# EAGLE design registers_manual3_2reg_newest (EAGLE 9.5.2)
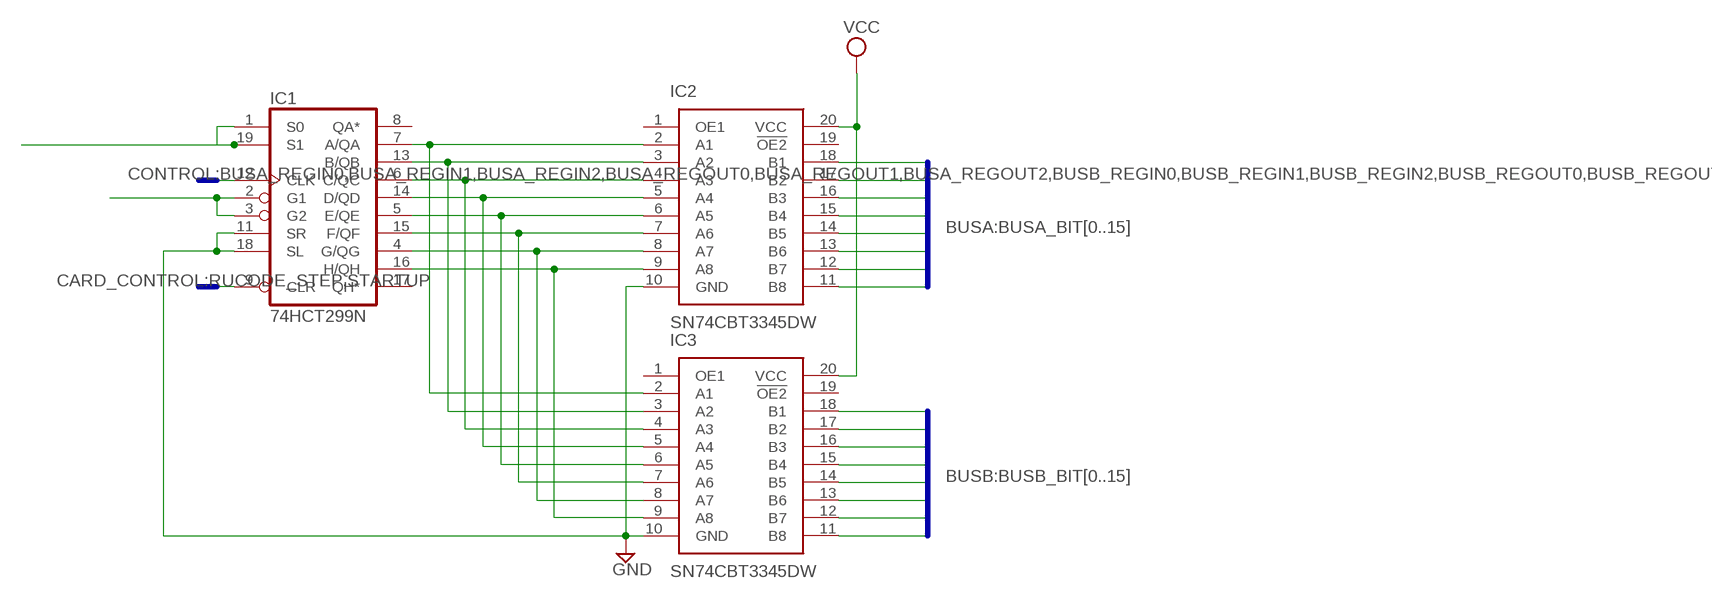
[diagram p0: schematic, sheet 1]

## Parts
IC1  74HCT299N  [DIL20]
IC2  SN74CBT3345DW  [SOIC127P1030X265-20N]
IC3  SN74CBT3345DW  [SOIC127P1030X265-20N]

## Nets
BUSA_BIT0: IC2.18(B1)
BUSA_BIT1: IC2.17(B2)
BUSA_BIT2: IC2.16(B3)
BUSA_BIT3: IC2.15(B4)
BUSA_BIT4: IC2.14(B5)
BUSA_BIT5: IC2.13(B6)
BUSA_BIT6: IC2.12(B7)
BUSA_BIT7: IC2.11(B8)
BUSB_BIT0: IC3.18(B1)
BUSB_BIT1: IC3.17(B2)
BUSB_BIT2: IC3.16(B3)
BUSB_BIT3: IC3.15(B4)
BUSB_BIT4: IC3.14(B5)
BUSB_BIT5: IC3.13(B6)
BUSB_BIT6: IC3.12(B7)
BUSB_BIT7: IC3.11(B8)
CLK: IC1.12(CLK)
GND: IC1.11(SR) IC1.18(SL) IC2.10(GND) IC3.10(GND)
N$12: IC1.2(G1) IC1.3(G2)
N$13: IC1.1(S0) IC1.19(S1)
N$14: IC1.7(A/QA) IC2.2(A1) IC3.2(A1)
N$18: IC1.13(B/QB) IC2.3(A2) IC3.3(A2)
N$20: IC1.6(C/QC) IC2.4(A3) IC3.4(A3)
N$26: IC1.14(D/QD) IC2.5(A4) IC3.5(A4)
N$27: IC1.5(E/QE) IC2.6(A5) IC3.6(A5)
N$29: IC1.15(F/QF) IC2.7(A6) IC3.7(A6)
N$30: IC1.4(G/QG) IC2.8(A7) IC3.8(A7)
N$31: IC1.16(H/QH) IC2.9(A8) IC3.9(A8)
STARTUP: IC1.9(CLR)
VCC: IC2.20(VCC) IC3.20(VCC)
Unconnected: IC1.8(QA*) IC1.17(QH*) IC2.1(OE1) IC2.19(!OE2) IC3.1(OE1) IC3.19(!OE2)

## Buses
CONTROL:BUSA_REGIN0,BUSA_REGIN1,BUSA_REGIN2,BUSA_REGOUT0,BUSA_REGOUT1,BUSA_REGOUT2,BUSB_REGIN0,BUSB_REGIN1,BUSB_REGIN2,BUSB_REGOUT0,BUSB_REGOUT1,BUSB_REGOUT2,CLK
CARD_CONTROL:RUCODE_STEP,STARTUP
BUSA:BUSA_BIT[0..15]
BUSB:BUSB_BIT[0..15]

## Power pins joined to a net without a drawn wire
GND: IC1.10(GND)
VCC: IC1.20(VCC)

## Library data of the parts
IC1 = 74xx-eu:74*299: 8-bit universal SHIFT/STORAGE REGISTER
IC2 IC3 = SamacSys_Parts:SN74CBT3345DW: Texas Instruments SN74CBT3345DW, Bus Switch, 8 x 1:1, 4.5 5.5 V, 20-Pin SOIC Source: Datasheet <https://www.ti.com/lit/ds/symlink/sn74cbt3345.pdf>; DESCRIPTION: Texas Instruments SN74CBT3345DW, Bus Switch, 8 x 1:1, 4.5 5.5 V, 20-Pin SOIC; HEIGHT: 2.65mm; MANUFACTURER_NAME: Texas Instruments; MANUFACTURER_PART_NUMBER: SN74CBT3345DW

## Board
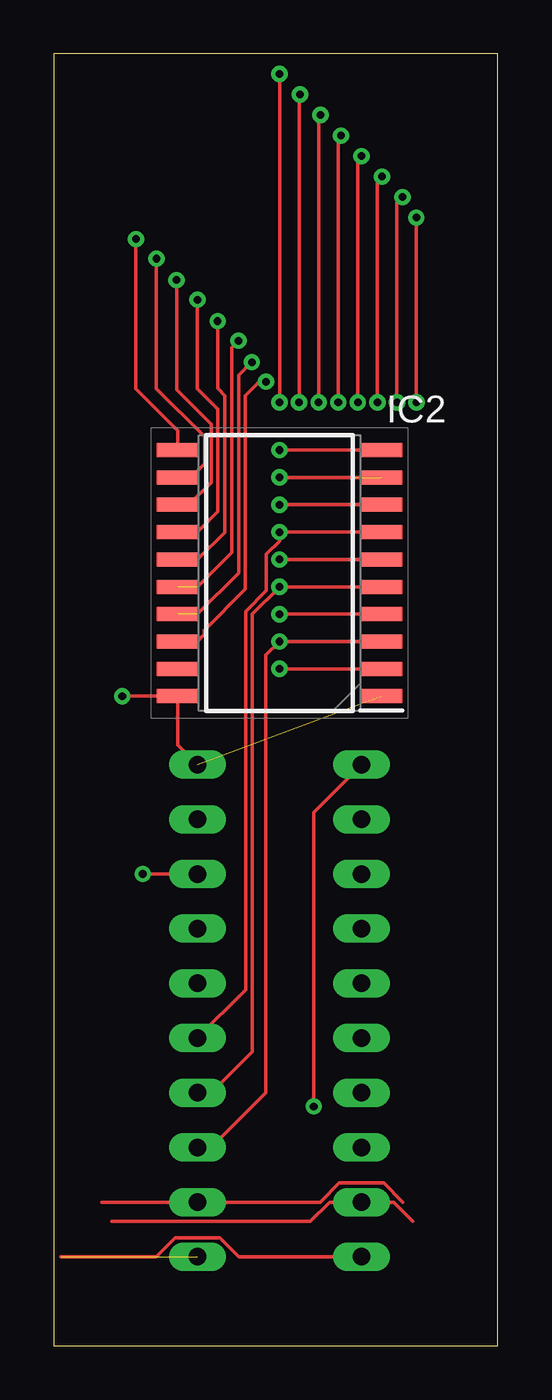
[diagram p1: board, top side]
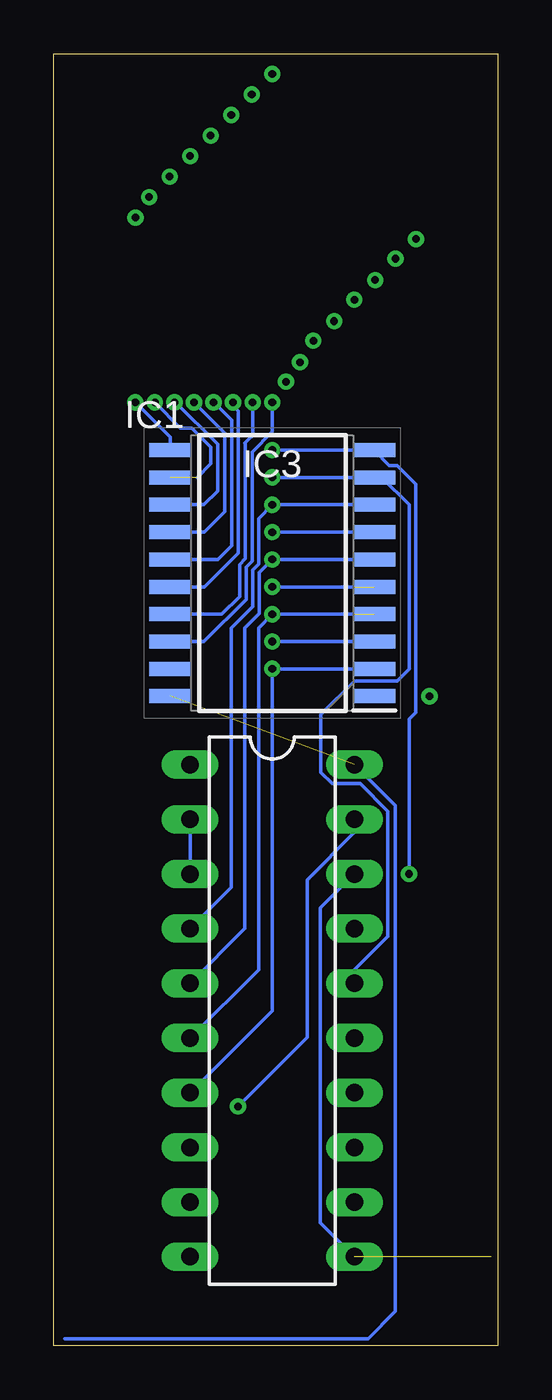
[diagram p2: board, bottom side, seen from below]

Size 20.62 x 59.99 mm. Coordinates in mm from the lower left corner, seen from the top.
Outline: 0,0 20.62,0 20.62,59.99 0,59.99 0,0
Copper layers (1*16): Top 0.035mm / dielectric 1.5mm / Bottom 0.035mm
Design rules "default *": minimum track width 6mil, minimum drill 0.35mm, track to track 6mil, track to pad 6mil, pad to pad 6mil, via to via 6mil, smd to smd 6mil, copper to edge 40mil, drill to drill 6mil, minimum pad ring 10mil, minimum via ring 8mil, stop-mask expansion 4mil, vias tented up to drill 0mil, thermal gap 10mil

### Footprints (pad centres in the part's own frame; a part is rotated, then mirrored left to right if it is on the bottom)
DIL20 = drill 0.813 long: 1 -11.43,-3.81; 2 -8.89,-3.81; 3 -6.35,-3.81; 4 -3.81,-3.81; 5 -1.27,-3.81; 6 1.27,-3.81; 7 3.81,-3.81; 8 6.35,-3.81; 9 8.89,-3.81; 10 11.43,-3.81; 11 11.43,3.81; 12 8.89,3.81; 13 6.35,3.81; 14 3.81,3.81; 15 1.27,3.81; 16 -1.27,3.81; 17 -3.81,3.81; 18 -6.35,3.81; 19 -8.89,3.81; 20 -11.43,3.81
SOIC127P1030X265-20N = smd 1.95 x 0.65: 1 -4.725,5.715; 2 -4.725,4.445; 3 -4.725,3.175; 4 -4.725,1.905; 5 -4.725,0.635; 6 -4.725,-0.635; 7 -4.725,-1.905; 8 -4.725,-3.175; 9 -4.725,-4.445; 10 -4.725,-5.715; 11 4.725,-5.715; 12 4.725,-4.445; 13 4.725,-3.175; 14 4.725,-1.905; 15 4.725,-0.635; 16 4.725,0.635; 17 4.725,1.905; 18 4.725,3.175; 19 4.725,4.445; 20 4.725,5.715

### Placement (x,y rotation side)
IC1  10.48,15.56 270 bottom
IC2  10.48,35.88 180 top
IC3  10.48,35.88 180 bottom

### Tracks (layer width: path | path; a pad name or v marks a point on that pad's centre or on a via)
BUSA_BIT0  (via drill 0.35)
  Top 0.152: 6.35,32.7 IC2.18 6.67,32.7 6.99,33.02 6.99,33.22 8.89,35.13 8.89,44.13 9.52,44.77 v9.84,44.77
BUSA_BIT1  (via drill 0.35)  (1 unrouted)
  Top 0.152: 6.67,33.97 8.57,35.88 8.57,45.09 9.16,45.68 v9.19,45.68
BUSA_BIT2  (via drill 0.35)  (1 unrouted)
  Top 0.152: v8.57,46.67 8.25,46.35 8.25,36.83 6.67,35.24
BUSA_BIT3  (via drill 0.35)
  Top 0.152: v7.6,47.58 7.6,44.47 7.94,44.13 7.92,44.12 7.92,37.77 6.67,36.51 IC2.15
BUSA_BIT4  (via drill 0.35)
  Top 0.152: v6.67,48.58 6.67,44.45 7.62,43.5 7.62,38.74 6.67,37.78 IC2.14
BUSA_BIT5  (via drill 0.35)
  Top 0.152: IC2.13 6.27,39.05 7.3,40.09 7.3,42.8 5.7,44.41 v5.7,49.49
BUSA_BIT6  (via drill 0.35)
  Top 0.152: v4.76,50.48 4.76,44.45 7,42.21 7,40.96 6.36,40.32 IC2.12
BUSA_BIT7  (via drill 0.35)
  Top 0.152: 5.99,41.59 IC2.11 5.75,42.51 3.81,44.45 v3.81,51.39
BUSB_BIT0  (via drill 0.35)
  Top 0.152: v10.48,43.81 v10.48,59.06
  Bottom 0.152: IC3.18 13.65,32.7 11.69,34.66 11.69,36.16 11.42,36.43 11.42,41.51 10.48,42.45 v10.48,43.81
BUSB_BIT1  (via drill 0.35)
  Top 0.152: v11.39,43.81 11.39,58.06 v11.43,58.1
  Bottom 0.152: 11.76,41.91 11.75,41.92 | 11.75,41.92 11.44,42.23 11.43,42.23 11.39,42.27 v11.39,43.81 | IC3.17 12.81,33.97 12,34.79 12,36.28 11.72,36.56 11.72,41.88 11.75,41.92
BUSB_BIT2  (via drill 0.35)
  Top 0.152: v12.3,43.81 12.3,57.06 v12.38,57.15
  Bottom 0.152: IC3.16 13.63,35.24 12.07,36.8 12.07,43.41 12.3,43.64 v12.3,43.81
BUSB_BIT3  (via drill 0.35)
  Top 0.152: v13.2,43.81 13.2,56.07 v13.33,56.2
  Bottom 0.152: v13.2,43.81 12.37,42.98 12.37,37.15 13,36.51 IC3.15
BUSB_BIT4  (via drill 0.35)
  Top 0.152: v14.11,43.81 14.11,55.07 v14.29,55.24
  Bottom 0.152: IC3.14 13.63,37.78 12.67,38.74 12.67,42.38 v14.11,43.81
BUSB_BIT5  (via drill 0.35)
  Top 0.152: v15.02,43.81 15.02,54.07 v15.24,54.29
  Bottom 0.152: IC3.13 13.65,39.05 13.02,39.69 13.02,41.86 14.97,43.81 v15.02,43.81
BUSB_BIT6  (via drill 0.35)  (1 unrouted)
  Top 0.152: v15.93,43.81 15.93,53.08 v16.19,53.34
  Bottom 0.152: 13.96,40.32 13.32,40.96 13.32,41.74 14.21,42.62 14.74,42.62 v15.93,43.81
BUSB_BIT7  (via drill 0.35)
  Top 0.152: v16.84,43.81 v16.83,43.83 v16.83,52.39
  Bottom 0.152: IC3.11 15.2,42.19 v16.83,43.81 v16.84,43.81
CLK
  Top 0.152: 2.24,6.67 IC1.12 12.37,6.67 13.26,7.56 15.32,7.56 16.21,6.67
GND  (via drill 0.35)  (1 unrouted)
  Top 0.152: 0.32,4.13 4.75,4.13 5.64,5.02 7.7,5.02 8.59,4.13 IC1.10 | v10.48,41.59 IC2.10 | v4.13,21.91 IC1.18
  Bottom 0.152: IC1.18 8.25,20.32 8.25,5.72 IC1.11 | v10.48,41.59 IC3.10 5.04,40.88 4.68,40.88 3.82,40.02 3.82,29.4 4.13,29.1 v4.13,21.91
N$12
  Bottom 0.152: IC1.2 IC1.3
N$13  (via drill 0.35)
  Top 0.152: v12.07,11.11 12.07,24.77 IC1.1
  Bottom 0.152: IC1.19 6.67,23.83 8.85,21.64 8.85,14.33 v12.07,11.11
N$14  (via drill 0.35)
  Top 0.152: v10.48,31.43 IC2.2
  Bottom 0.152: IC3.2 v10.48,31.43 10.48,15.56 IC1.7
N$18  (via drill 0.35)
  Top 0.152: IC2.3 v10.48,32.7 9.84,32.07 9.84,11.75 7.3,9.21 IC1.13
  Bottom 0.152: v10.48,32.7 IC3.3
N$20  (via drill 0.35)
  Top 0.152: v10.48,33.97 IC2.4
  Bottom 0.152: IC3.4 v10.48,33.97 11.11,33.34 11.11,17.46 IC1.6
N$26  (via drill 0.35)
  Top 0.152: IC2.5 v10.48,35.24 9.21,33.97 9.21,13.65 7.3,11.75 IC1.14
  Bottom 0.152: IC3.5 v10.48,35.24
N$27  (via drill 0.35)
  Top 0.152: v10.48,36.51 IC2.6
  Bottom 0.152: IC3.6 v10.48,36.51 11.08,35.91 11.08,34 11.75,33.34 11.75,19.37 IC1.5
N$29  (via drill 0.35)
  Top 0.152: IC2.7 v10.48,37.78 10.48,37.37 9.87,36.76 9.87,35.07 8.9,34.1 8.9,16.52 IC1.15
  Bottom 0.152: IC3.7 v10.48,37.78
N$30  (via drill 0.35)
  Top 0.152: v10.48,39.05 IC2.8
  Bottom 0.152: IC3.8 v10.48,39.05 11.11,38.42 11.11,36.31 11.39,36.03 11.39,34.33 12.38,33.34 12.38,21.27 IC1.4
N$31  (via drill 0.35)
  Top 0.152: v10.48,40.32 IC2.9
  Bottom 0.152: v10.48,40.32 IC3.9 5.4,40.32 4.13,39.05 4.13,31.43 4.68,30.88 6.66,30.88 8.22,29.32 8.22,26.62 7.7,26.1 6.4,26.1 5.12,24.82 5.12,19 6.67,17.45 IC1.16
STARTUP
  Top 0.152: 2.69,5.78 11.91,5.78 12.8,6.67 IC1.9 15.77,6.67 16.66,5.78
VCC  (via drill 0.35)  (1 unrouted)
  Top 0.152: 6.03,30.16 IC2.20 | IC2.20 5.75,27.9 IC1.20 | v3.18,30.16 IC2.20
  Bottom 0.152: IC1.20 4.76,25.08 4.76,1.59 6.03,0.32 20.1,0.32